# Altium schematic sheet MCU_Connections.SchDoc
size A3; SheetNumber: 2; SheetTotal: 13
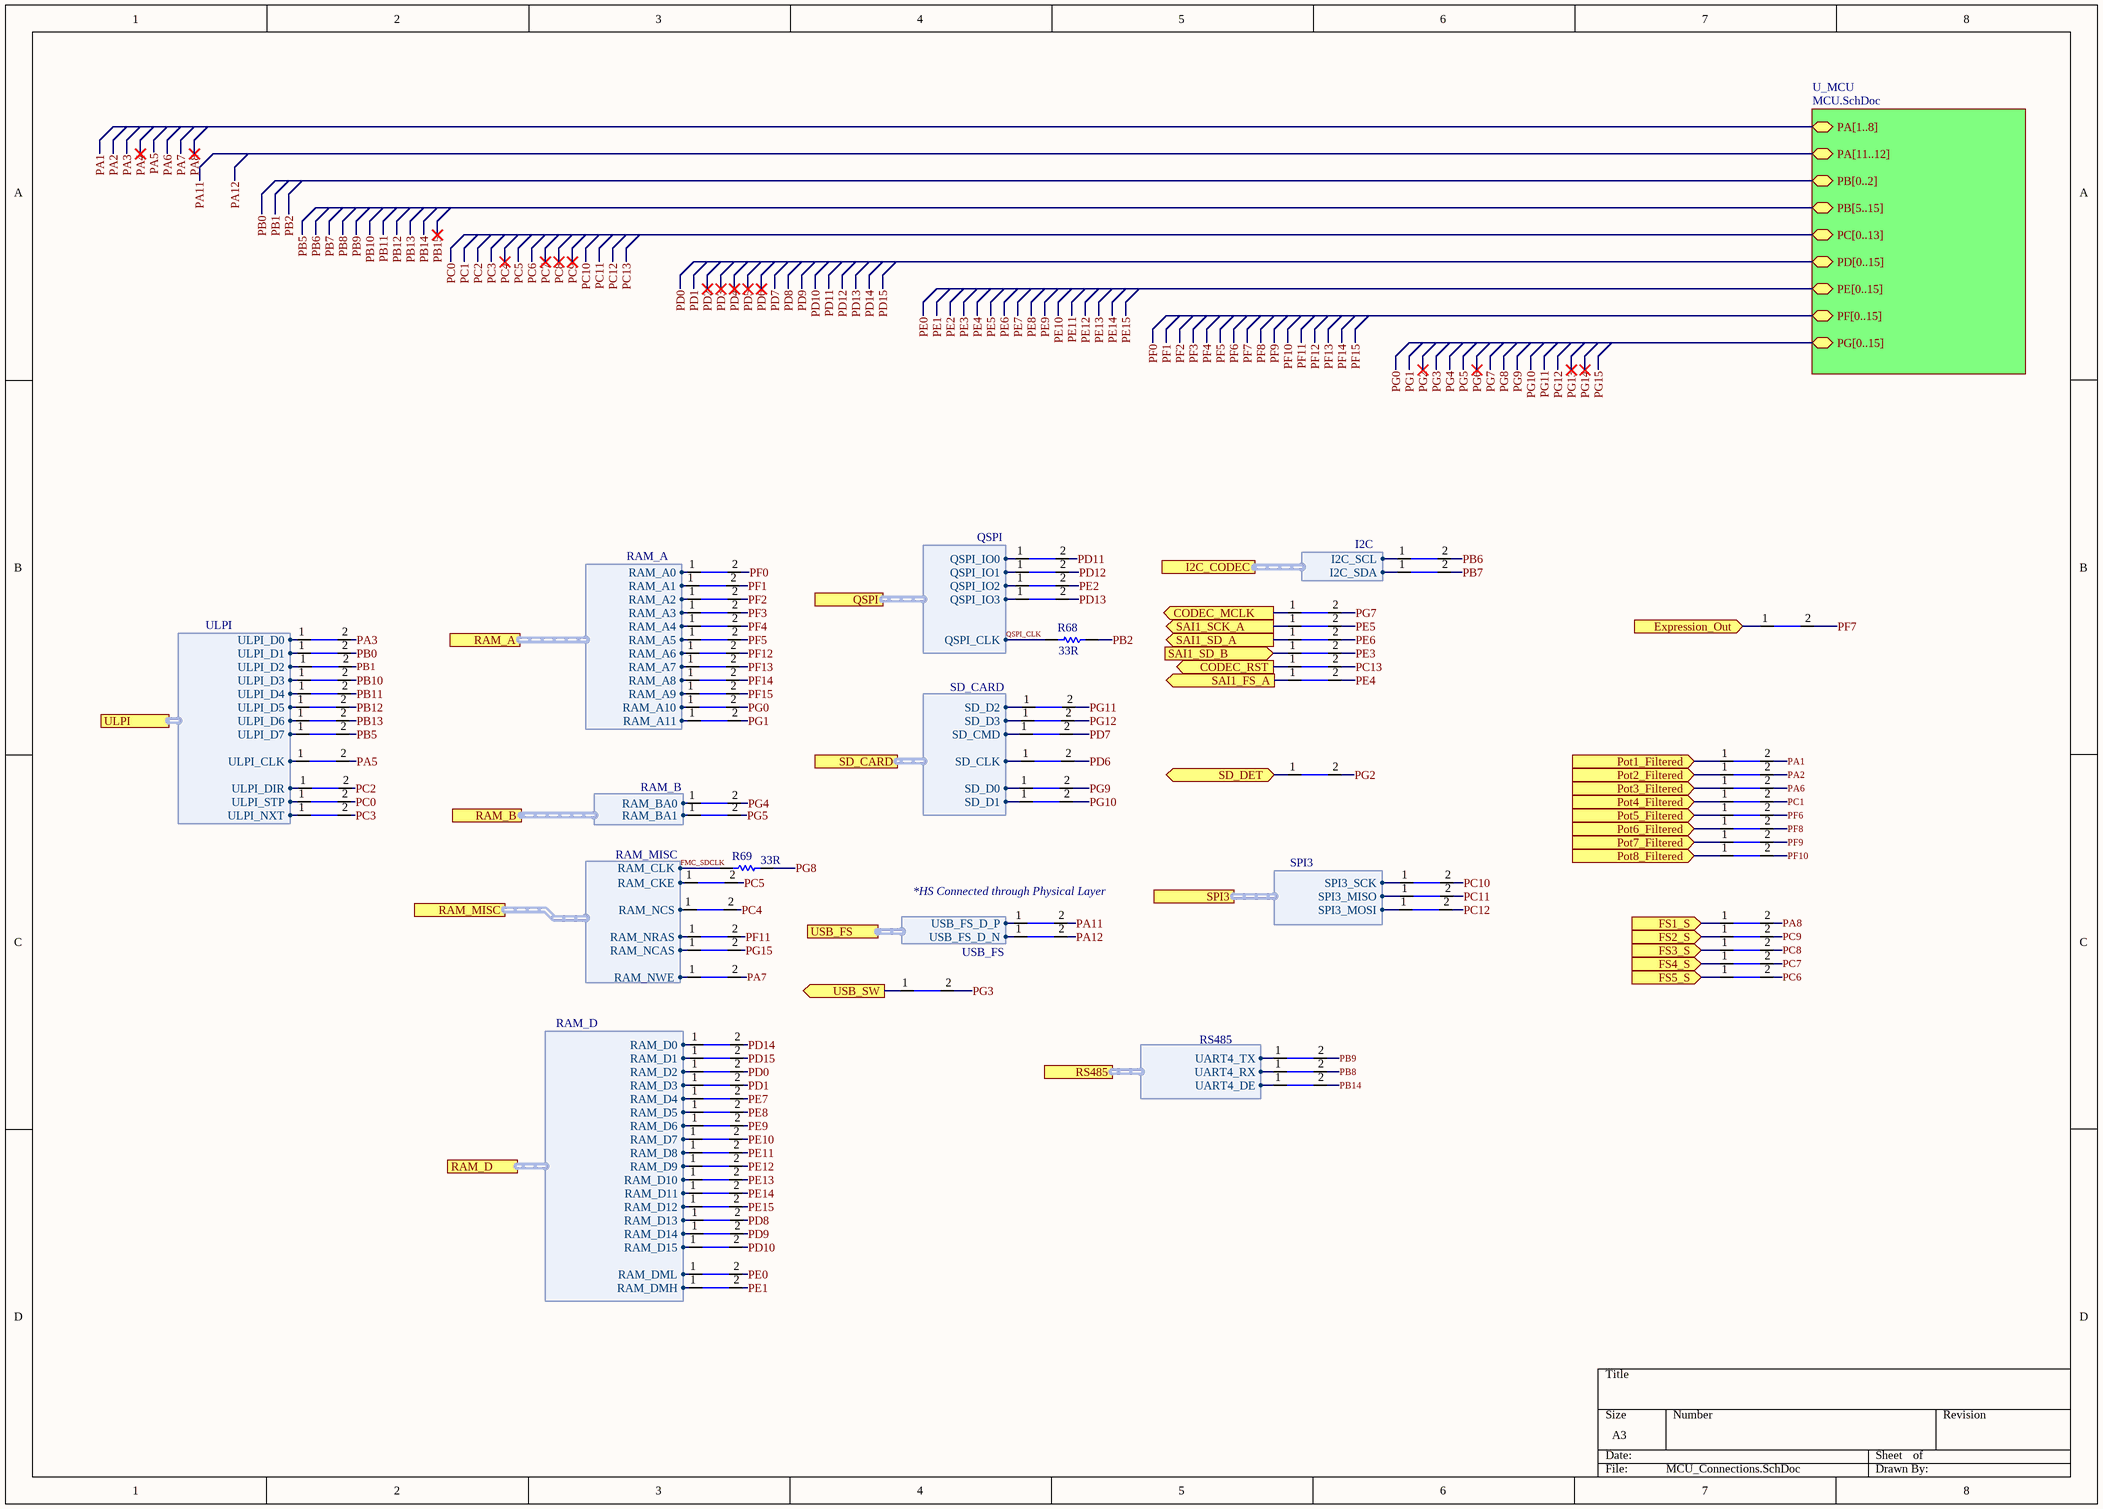
[diagram p0: MCU_Connections.SchDoc]

## Parts
NT1  NetTie_SMD  [NETTIE_SMD]  (value not drawn)  (net tie, no BOM)
NT2  NetTie_SMD  [NETTIE_SMD]  (value not drawn)  (net tie, no BOM)
NT3  NetTie_SMD  [NETTIE_SMD]  (value not drawn)  (net tie, no BOM)
NT4  NetTie_SMD  [NETTIE_SMD]  (value not drawn)  (net tie, no BOM)
NT5  NetTie_SMD  [NETTIE_SMD]  (value not drawn)  (net tie, no BOM)
NT6  NetTie_SMD  [NETTIE_SMD]  (value not drawn)  (net tie, no BOM)
NT7  NetTie_SMD  [NETTIE_SMD]  (value not drawn)  (net tie, no BOM)
NT8  NetTie_SMD  [NETTIE_SMD]  (value not drawn)  (net tie, no BOM)
NT9  NetTie_SMD  [NETTIE_SMD]  (value not drawn)  (net tie, no BOM)
NT10  NetTie_SMD  [NETTIE_SMD]  (value not drawn)  (net tie, no BOM)
NT11  NetTie_SMD  [NETTIE_SMD]  (value not drawn)  (net tie, no BOM)
NT12  NetTie_SMD  [NETTIE_SMD]  (value not drawn)  (net tie, no BOM)
NT13  NetTie_SMD  [NETTIE_SMD]  (value not drawn)  (net tie, no BOM)
NT14  NetTie_SMD  [NETTIE_SMD]  (value not drawn)  (net tie, no BOM)
NT15  NetTie_SMD  [NETTIE_SMD]  (value not drawn)  (net tie, no BOM)
NT16  NetTie_SMD  [NETTIE_SMD]  (value not drawn)  (net tie, no BOM)
NT17  NetTie_SMD  [NETTIE_SMD]  (value not drawn)  (net tie, no BOM)
NT18  NetTie_SMD  [NETTIE_SMD]  (value not drawn)  (net tie, no BOM)
NT19  NetTie_SMD  [NETTIE_SMD]  (value not drawn)  (net tie, no BOM)
NT20  NetTie_SMD  [NETTIE_SMD]  (value not drawn)  (net tie, no BOM)
NT21  NetTie_SMD  [NETTIE_SMD]  (value not drawn)  (net tie, no BOM)
NT22  NetTie_SMD  [NETTIE_SMD]  (value not drawn)  (net tie, no BOM)
NT23  NetTie_SMD  [NETTIE_SMD]  (value not drawn)  (net tie, no BOM)
NT24  NetTie_SMD  [NETTIE_SMD]  (value not drawn)  (net tie, no BOM)
NT25  NetTie_SMD  [NETTIE_SMD]  (value not drawn)  (net tie, no BOM)
NT26  NetTie_SMD  [NETTIE_SMD]  (value not drawn)  (net tie, no BOM)
NT27  NetTie_SMD  [NETTIE_SMD]  (value not drawn)  (net tie, no BOM)
NT28  NetTie_SMD  [NETTIE_SMD]  (value not drawn)  (net tie, no BOM)
NT29  NetTie_SMD  [NETTIE_SMD]  (value not drawn)  (net tie, no BOM)
NT30  NetTie_SMD  [NETTIE_SMD]  (value not drawn)  (net tie, no BOM)
NT31  NetTie_SMD  [NETTIE_SMD]  (value not drawn)  (net tie, no BOM)
NT32  NetTie_SMD  [NETTIE_SMD]  (value not drawn)  (net tie, no BOM)
NT33  NetTie_SMD  [NETTIE_SMD]  (value not drawn)  (net tie, no BOM)
NT34  NetTie_SMD  [NETTIE_SMD]  (value not drawn)  (net tie, no BOM)
NT35  NetTie_SMD  [NETTIE_SMD]  (value not drawn)  (net tie, no BOM)
NT36  NetTie_SMD  [NETTIE_SMD]  (value not drawn)  (net tie, no BOM)
NT37  NetTie_SMD  [NETTIE_SMD]  (value not drawn)  (net tie, no BOM)
NT38  NetTie_SMD  [NETTIE_SMD]  (value not drawn)  (net tie, no BOM)
NT39  NetTie_SMD  [NETTIE_SMD]  (value not drawn)  (net tie, no BOM)
NT40  NetTie_SMD  [NETTIE_SMD]  (value not drawn)  (net tie, no BOM)
NT41  NetTie_SMD  [NETTIE_SMD]  (value not drawn)  (net tie, no BOM)
NT42  NetTie_SMD  [NETTIE_SMD]  (value not drawn)  (net tie, no BOM)
NT43  NetTie_SMD  [NETTIE_SMD]  (value not drawn)  (net tie, no BOM)
NT44  NetTie_SMD  [NETTIE_SMD]  (value not drawn)  (net tie, no BOM)
NT45  NetTie_SMD  [NETTIE_SMD]  (value not drawn)  (net tie, no BOM)
NT46  NetTie_SMD  [NETTIE_SMD]  (value not drawn)  (net tie, no BOM)
NT47  NetTie_SMD  [NETTIE_SMD]  (value not drawn)  (net tie, no BOM)
NT48  NetTie_SMD  [NETTIE_SMD]  (value not drawn)  (net tie, no BOM)
NT49  NetTie_SMD  [NETTIE_SMD]  (value not drawn)  (net tie, no BOM)
NT50  NetTie_SMD  [NETTIE_SMD]  (value not drawn)  (net tie, no BOM)
NT51  NetTie_SMD  [NETTIE_SMD]  (value not drawn)  (net tie, no BOM)
NT52  NetTie_SMD  [NETTIE_SMD]  (value not drawn)  (net tie, no BOM)
NT53  NetTie_SMD  [NETTIE_SMD]  (value not drawn)  (net tie, no BOM)
NT54  NetTie_SMD  [NETTIE_SMD]  (value not drawn)  (net tie, no BOM)
NT55  NetTie_SMD  [NETTIE_SMD]  (value not drawn)  (net tie, no BOM)
NT56  NetTie_SMD  [NETTIE_SMD]  (value not drawn)  (net tie, no BOM)
NT57  NetTie_SMD  [NETTIE_SMD]  (value not drawn)  (net tie, no BOM)
NT58  NetTie_SMD  [NETTIE_SMD]  (value not drawn)  (net tie, no BOM)
NT59  NetTie_SMD  [NETTIE_SMD]  (value not drawn)  (net tie, no BOM)
NT60  NetTie_SMD  [NETTIE_SMD]  (value not drawn)  (net tie, no BOM)
NT61  NetTie_SMD  [NETTIE_SMD]  (value not drawn)  (net tie, no BOM)
NT62  NetTie_SMD  [NETTIE_SMD]  (value not drawn)  (net tie, no BOM)
NT63  NetTie_SMD  [NETTIE_SMD]  (value not drawn)  (net tie, no BOM)
NT64  NetTie_SMD  [NETTIE_SMD]  (value not drawn)  (net tie, no BOM)
NT65  NetTie_SMD  [NETTIE_SMD]  (value not drawn)  (net tie, no BOM)
NT66  NetTie_SMD  [NETTIE_SMD]  (value not drawn)  (net tie, no BOM)
NT67  NetTie_SMD  [NETTIE_SMD]  (value not drawn)  (net tie, no BOM)
NT68  NetTie_SMD  [NETTIE_SMD]  (value not drawn)  (net tie, no BOM)
NT69  NetTie_SMD  [NETTIE_SMD]  (value not drawn)  (net tie, no BOM)
NT70  NetTie_SMD  [NETTIE_SMD]  (value not drawn)  (net tie, no BOM)
NT71  NetTie_SMD  [NETTIE_SMD]  (value not drawn)  (net tie, no BOM)
NT72  NetTie_SMD  [NETTIE_SMD]  (value not drawn)  (net tie, no BOM)
NT73  NetTie_SMD  [NETTIE_SMD]  (value not drawn)  (net tie, no BOM)
NT74  NetTie_SMD  [NETTIE_SMD]  (value not drawn)  (net tie, no BOM)
NT75  NetTie_SMD  [NETTIE_SMD]  (value not drawn)  (net tie, no BOM)
NT76  NetTie_SMD  [NETTIE_SMD]  (value not drawn)  (net tie, no BOM)
NT77  NetTie_SMD  [NETTIE_SMD]  (value not drawn)  (net tie, no BOM)
NT78  NetTie_SMD  [NETTIE_SMD]  (value not drawn)  (net tie, no BOM)
NT79  NetTie_SMD  [NETTIE_SMD]  (value not drawn)  (net tie, no BOM)
NT80  NetTie_SMD  [NETTIE_SMD]  (value not drawn)  (net tie, no BOM)
NT81  NetTie_SMD  [NETTIE_SMD]  (value not drawn)  (net tie, no BOM)
NT82  NetTie_SMD  [NETTIE_SMD]  (value not drawn)  (net tie, no BOM)
NT83  NetTie_SMD  [NETTIE_SMD]  (value not drawn)  (net tie, no BOM)
NT84  NetTie_SMD  [NETTIE_SMD]  (value not drawn)  (net tie, no BOM)
NT85  NetTie_SMD  [NETTIE_SMD]  (value not drawn)  (net tie, no BOM)
NT86  NetTie_SMD  [NETTIE_SMD]  (value not drawn)  (net tie, no BOM)
NT87  NetTie_SMD  [NETTIE_SMD]  (value not drawn)  (net tie, no BOM)
NT88  NetTie_SMD  [NETTIE_SMD]  (value not drawn)  (net tie, no BOM)
NT89  NetTie_SMD  [NETTIE_SMD]  (value not drawn)  (net tie, no BOM)
NT90  NetTie_SMD  [NETTIE_SMD]  (value not drawn)  (net tie, no BOM)
NT91  NetTie_SMD  [NETTIE_SMD]  (value not drawn)  (net tie, no BOM)
R68  Resistance: 33R  [RESC1005X40X25ML05T10]  (hidden comment: RC0402JR-1333RL)
R69  Resistance: 33R  [RESC1005X40X25ML05T10]  (hidden comment: RC0402JR-1333RL)

## Sub-sheets
U_MCU = MCU.SchDoc: PA[1..8] (bidir), PA[11..12] (bidir), PB[0..2] (bidir), PB[5..15] (bidir), PC[0..13] (bidir), PD[0..15] (bidir), PE[0..15] (bidir), PF[0..15] (bidir), PG[0..15] (bidir)

## Ports
CODEC_MCLK (out, see high_level[5A], Codec[3B]), CODEC_RST (out, see high_level[5A], Codec[4A]), Expression_Out (in, see high_level[5A], Expression_Pedal[6B]), FS1_S (in, see high_level[4B], Footswitches[3C]), FS2_S (in, see high_level[4B], Footswitches[4C]), FS3_S (in, see high_level[4B], Footswitches[5C]), FS4_S (in, see high_level[4B], Footswitches[5C]), FS5_S (in, see high_level[4B], Footswitches[6C]), I2C_CODEC (harness I2C, see high_level[5A], Codec[2C]), Pot1_Filtered (in, see high_level[4B], Potentiometers[3B]), Pot2_Filtered (in, see high_level[4B], Potentiometers[3B]), Pot3_Filtered (in, see high_level[4B], Potentiometers[3C]), Pot4_Filtered (in, see high_level[4B], Potentiometers[6B]), Pot5_Filtered (in, see high_level[4B], Potentiometers[6B]), Pot6_Filtered (in, see high_level[4B], Potentiometers[6C]), Pot7_Filtered (in, see high_level[4B], Potentiometers[3D]), Pot8_Filtered (in, see high_level[4B], Potentiometers[6D]), QSPI (harness QSPI, see high_level[4A], Memory[5A]), RAM_A (harness RAM_A, see high_level[4A], Memory[1B]), RAM_B (harness RAM_B, see high_level[4A], Memory[1B]), RAM_D (harness RAM_D, see high_level[4A], Memory[4B]), RAM_MISC (harness RAM_MISC, see high_level[4A], Memory[1B]), RS485 (harness RS485, see high_level[5B], Peripherals[5A]), SAI1_FS_A (out, see high_level[5A], Codec[3B]), SAI1_SCK_A (out, see high_level[5A], Codec[3B]), SAI1_SD_A (out, see high_level[5A], Codec[3B]), SAI1_SD_B (in, see high_level[5A], Codec[3B]), SD_CARD (harness SD_CARD, see high_level[4A], Memory[1C]), SD_DET (bidir, see high_level[4A], Memory[5C]), SPI3 (harness SPI3, see high_level[4B], Peripherals[2D]), ULPI (harness ULPI, see high_level[5B], USB_HS[7B]), USB_FS (harness USB_FS, see high_level[5B], Peripherals[4B]), USB_SW (out, see high_level[5B], Peripherals[2B])

## Harnesses
ULPI: ULPI_D0, ULPI_D1, ULPI_D2, ULPI_D3, ULPI_D4, ULPI_D5, ULPI_D6, ULPI_D7, ULPI_CLK, ULPI_DIR, ULPI_STP, ULPI_NXT
RAM_A: RAM_A0, RAM_A1, RAM_A2, RAM_A3, RAM_A4, RAM_A5, RAM_A6, RAM_A7, RAM_A8, RAM_A9, RAM_A10, RAM_A11
RAM_B: RAM_BA0, RAM_BA1
RAM_MISC: RAM_CLK, RAM_CKE, RAM_NCS, RAM_NRAS, RAM_NCAS, RAM_NWE
RAM_D: RAM_D0, RAM_D1, RAM_D2, RAM_D3, RAM_D4, RAM_D5, RAM_D6, RAM_D7, RAM_D8, RAM_D9, RAM_D10, RAM_D11, RAM_D12, RAM_D13, RAM_D14, RAM_D15, RAM_DML, RAM_DMH
QSPI: QSPI_IO0, QSPI_IO1, QSPI_IO3, QSPI_CLK, QSPI_IO2
SD_CARD: SD_D2, SD_D3, SD_CMD, SD_CLK, SD_D0, SD_D1
USB_FS: USB_FS_D_P, USB_FS_D_N
I2C: I2C_SCL, I2C_SDA
SPI3: SPI3_SCK, SPI3_MISO, SPI3_MOSI
RS485: UART4_TX, UART4_RX, UART4_DE

## Nets
CODEC_MCLK: NT11.1 ; port CODEC_MCLK
CODEC_RST: NT23.1 ; port CODEC_RST
Expression_Out: NT14.1 ; port Expression_Out
FMC_SDCLK: R69.1 ; port RAM_MISC.RAM_CLK
FS1_S: NT61.1 ; port FS1_S
FS2_S: NT64.1 ; port FS2_S
FS3_S: NT66.1 ; port FS3_S
FS4_S: NT67.1 ; port FS4_S
FS5_S: NT69.1 ; port FS5_S
PA1: NT39.2
PA2: NT41.2
PA3: NT15.2
PA5: NT37.2
PA6: NT44.2
PA7: NT68.2
PA8: NT61.2
PA11: NT60.2
PA12: NT63.2
PB0: NT18.2
PB1: NT21.2
PB2: R68.2
PB5: NT35.2
PB6: NT2.2
PB7: NT5.2
PB8: NT75.2
PB9: NT73.2
PB10: NT24.2
PB11: NT27.2
PB12: NT29.2
PB13: NT32.2
PB14: NT77.2
PC0: NT45.2
PC1: NT48.2
PC2: NT42.2
PC3: NT49.2
PC4: NT58.2
PC5: NT55.2
PC6: NT69.2
PC7: NT67.2
PC8: NT66.2
PC9: NT64.2
PC10: NT56.2
PC11: NT57.2
PC12: NT59.2
PC13: NT23.2
PD0: NT74.2
PD1: NT76.2
PD6: NT38.2
PD7: NT36.2
PD8: NT87.2
PD9: NT88.2
PD10: NT89.2
PD11: NT1.2
PD12: NT4.2
PD13: NT9.2
PD14: NT71.2
PD15: NT72.2
PE0: NT90.2
PE1: NT91.2
PE2: NT7.2
PE3: NT20.2
PE4: NT26.2
PE5: NT13.2
PE6: NT17.2
PE7: NT78.2
PE8: NT79.2
PE9: NT80.2
PE10: NT81.2
PE11: NT82.2
PE12: NT83.2
PE13: NT84.2
PE14: NT85.2
PE15: NT86.2
PF0: NT3.2
PF1: NT6.2
PF2: NT8.2
PF3: NT10.2
PF4: NT12.2
PF5: NT16.2
PF6: NT51.2
PF7: NT14.2
PF8: NT52.2
PF9: NT53.2
PF10: NT54.2
PF11: NT62.2
PF12: NT19.2
PF13: NT22.2
PF14: NT25.2
PF15: NT28.2
PG0: NT30.2
PG1: NT33.2
PG2: NT40.2
PG3: NT70.2
PG4: NT46.2
PG5: NT50.2
PG7: NT11.2
PG8: R69.2
PG9: NT43.2
PG10: NT47.2
PG11: NT31.2
PG12: NT34.2
PG15: NT65.2
Pot1_Filtered: NT39.1 ; port Pot1_Filtered
Pot2_Filtered: NT41.1 ; port Pot2_Filtered
Pot3_Filtered: NT44.1 ; port Pot3_Filtered
Pot4_Filtered: NT48.1 ; port Pot4_Filtered
Pot5_Filtered: NT51.1 ; port Pot5_Filtered
Pot6_Filtered: NT52.1 ; port Pot6_Filtered
Pot7_Filtered: NT53.1 ; port Pot7_Filtered
Pot8_Filtered: NT54.1 ; port Pot8_Filtered
QSPI_CLK: R68.1 ; port QSPI.QSPI_CLK
SAI1_FS_A: NT26.1 ; port SAI1_FS_A
SAI1_SCK_A: NT13.1 ; port SAI1_SCK_A
SAI1_SD_A: NT17.1 ; port SAI1_SD_A
SAI1_SD_B: NT20.1 ; port SAI1_SD_B
SD_DET: NT40.1 ; port SD_DET
USB_SW: NT70.1 ; port USB_SW
NetNT1_1: NT1.1 ; port QSPI.QSPI_IO0
NetNT2_1: NT2.1 ; port I2C_CODEC.I2C_SCL
NetNT3_1: NT3.1 ; port RAM_A.RAM_A0
NetNT4_1: NT4.1 ; port QSPI.QSPI_IO1
NetNT5_1: NT5.1 ; port I2C_CODEC.I2C_SDA
NetNT6_1: NT6.1 ; port RAM_A.RAM_A1
NetNT7_1: NT7.1 ; port QSPI.QSPI_IO2
NetNT8_1: NT8.1 ; port RAM_A.RAM_A2
NetNT9_1: NT9.1 ; port QSPI.QSPI_IO3
NetNT10_1: NT10.1 ; port RAM_A.RAM_A3
NetNT12_1: NT12.1 ; port RAM_A.RAM_A4
NetNT15_1: NT15.1 ; port ULPI.ULPI_D0
NetNT16_1: NT16.1 ; port RAM_A.RAM_A5
NetNT18_1: NT18.1 ; port ULPI.ULPI_D1
NetNT19_1: NT19.1 ; port RAM_A.RAM_A6
NetNT21_1: NT21.1 ; port ULPI.ULPI_D2
NetNT22_1: NT22.1 ; port RAM_A.RAM_A7
NetNT24_1: NT24.1 ; port ULPI.ULPI_D3
NetNT25_1: NT25.1 ; port RAM_A.RAM_A8
NetNT27_1: NT27.1 ; port ULPI.ULPI_D4
NetNT28_1: NT28.1 ; port RAM_A.RAM_A9
NetNT29_1: NT29.1 ; port ULPI.ULPI_D5
NetNT30_1: NT30.1 ; port RAM_A.RAM_A10
NetNT31_1: NT31.1 ; port SD_CARD.SD_D2
NetNT32_1: NT32.1 ; port ULPI.ULPI_D6
NetNT33_1: NT33.1 ; port RAM_A.RAM_A11
NetNT34_1: NT34.1 ; port SD_CARD.SD_D3
NetNT35_1: NT35.1 ; port ULPI.ULPI_D7
NetNT36_1: NT36.1 ; port SD_CARD.SD_CMD
NetNT37_1: NT37.1 ; port ULPI.ULPI_CLK
NetNT38_1: NT38.1 ; port SD_CARD.SD_CLK
NetNT42_1: NT42.1 ; port ULPI.ULPI_DIR
NetNT43_1: NT43.1 ; port SD_CARD.SD_D0
NetNT45_1: NT45.1 ; port ULPI.ULPI_STP
NetNT46_1: NT46.1 ; port RAM_B.RAM_BA0
NetNT47_1: NT47.1 ; port SD_CARD.SD_D1
NetNT49_1: NT49.1 ; port ULPI.ULPI_NXT
NetNT50_1: NT50.1 ; port RAM_B.RAM_BA1
NetNT55_1: NT55.1 ; port RAM_MISC.RAM_CKE
NetNT56_1: NT56.1 ; port SPI3.SPI3_SCK
NetNT57_1: NT57.1 ; port SPI3.SPI3_MISO
NetNT58_1: NT58.1 ; port RAM_MISC.RAM_NCS
NetNT59_1: NT59.1 ; port SPI3.SPI3_MOSI
NetNT60_1: NT60.1 ; port USB_FS.USB_FS_D_P
NetNT62_1: NT62.1 ; port RAM_MISC.RAM_NRAS
NetNT63_1: NT63.1 ; port USB_FS.USB_FS_D_N
NetNT65_1: NT65.1 ; port RAM_MISC.RAM_NCAS
NetNT68_1: NT68.1 ; port RAM_MISC.RAM_NWE
NetNT71_1: NT71.1 ; port RAM_D.RAM_D0
NetNT72_1: NT72.1 ; port RAM_D.RAM_D1
NetNT73_1: NT73.1 ; port RS485.UART4_TX
NetNT74_1: NT74.1 ; port RAM_D.RAM_D2
NetNT75_1: NT75.1 ; port RS485.UART4_RX
NetNT76_1: NT76.1 ; port RAM_D.RAM_D3
NetNT77_1: NT77.1 ; port RS485.UART4_DE
NetNT78_1: NT78.1 ; port RAM_D.RAM_D4
NetNT79_1: NT79.1 ; port RAM_D.RAM_D5
NetNT80_1: NT80.1 ; port RAM_D.RAM_D6
NetNT81_1: NT81.1 ; port RAM_D.RAM_D7
NetNT82_1: NT82.1 ; port RAM_D.RAM_D8
NetNT83_1: NT83.1 ; port RAM_D.RAM_D9
NetNT84_1: NT84.1 ; port RAM_D.RAM_D10
NetNT85_1: NT85.1 ; port RAM_D.RAM_D11
NetNT86_1: NT86.1 ; port RAM_D.RAM_D12
NetNT87_1: NT87.1 ; port RAM_D.RAM_D13
NetNT88_1: NT88.1 ; port RAM_D.RAM_D14
NetNT89_1: NT89.1 ; port RAM_D.RAM_D15
NetNT90_1: NT90.1 ; port RAM_D.RAM_DML
NetNT91_1: NT91.1 ; port RAM_D.RAM_DMH

## Notes on the sheet
- *HS Connected through Physical Layer

## Library data of the parts
NT1-NT91 = CMP-026-000007-1: Net Tie; altium.hash: E97C61A79E216CA6C80CDA4F77C18B20; Design Item ID: NetTie_SMD; Source: HotBoardReal.SCHLIB
R68 R69 = CMP-2002-08082-1: Manufacturer: Yageo; Part Number: RC0402JR-1333RL